# Altium schematic sheet SCH_06_Analog_Mux.SchDoc
size A4; SheetNumber: 11; SheetTotal: 14; SPICEModelCacheGMSWIORD: <root> / <DocumentId>GMSWIORD</DocumentId> / <CacheFrame Number="0"> / <Model Name="0603_885012206095_100nf" Kind="CKT"> / <Text>******* / .subckt 0603_885012206095_100nF 1 2 / Rser 1 3 0.0157659152881 / Lser 2 4 3.10171966E-10 / C1 3 4 0.0000001 / Rpar 3 4 5000000000 / .ends 0603_885012206095_100nF</Text> / </Model> / </CacheFrame> / </root>
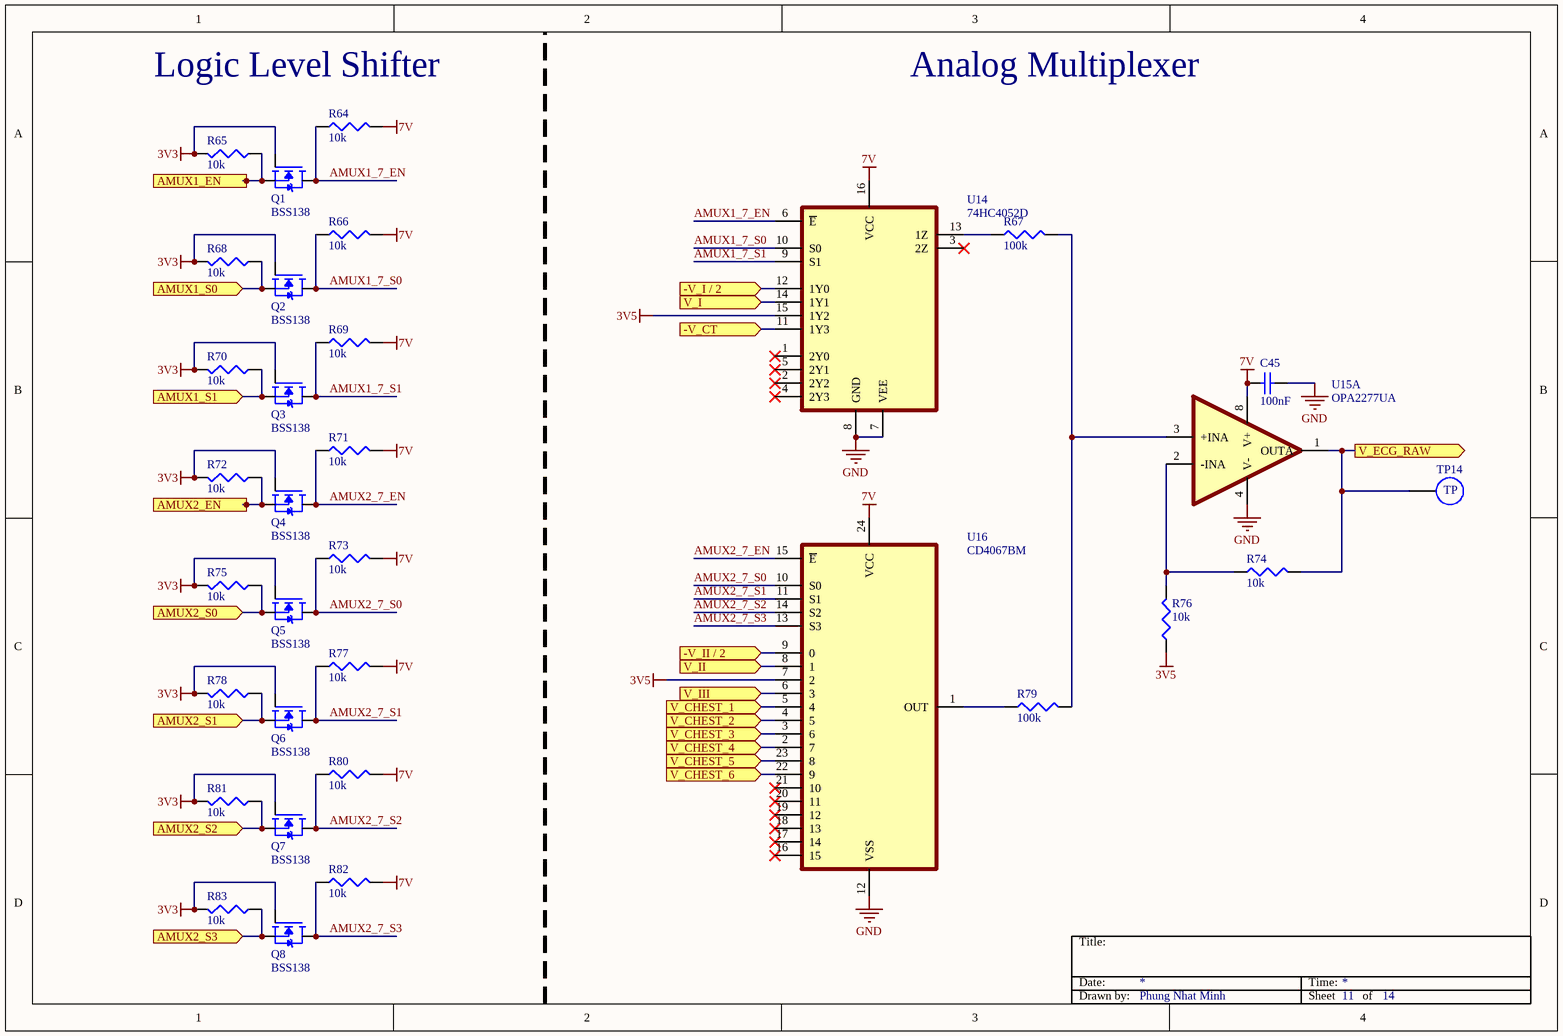
[diagram p0: SCH_06_Analog_Mux.SchDoc]

## Parts
C45  100nF  [WCAP-CSGP_0603_L1.6W0.8H0.8_Reflow]
Q1  BSS138  [SOT95P240X111-3N]
Q2  BSS138  [SOT95P240X111-3N]
Q3  BSS138  [SOT95P240X111-3N]
Q4  BSS138  [SOT95P240X111-3N]
Q5  BSS138  [SOT95P240X111-3N]
Q6  BSS138  [SOT95P240X111-3N]
Q7  BSS138  [SOT95P240X111-3N]
Q8  BSS138  [SOT95P240X111-3N]
R64  10k  [WRIS-PSMB_0603_L1.6W0.8H0.35]
R65  10k  [WRIS-PSMB_0603_L1.6W0.8H0.35]
R66  10k  [WRIS-PSMB_0603_L1.6W0.8H0.35]
R67  100k  [WRIS-PSMB_0603_L1.6W0.8H0.35]
R68  10k  [WRIS-PSMB_0603_L1.6W0.8H0.35]
R69  10k  [WRIS-PSMB_0603_L1.6W0.8H0.35]
R70  10k  [WRIS-PSMB_0603_L1.6W0.8H0.35]
R71  10k  [WRIS-PSMB_0603_L1.6W0.8H0.35]
R72  10k  [WRIS-PSMB_0603_L1.6W0.8H0.35]
R73  10k  [WRIS-PSMB_0603_L1.6W0.8H0.35]
R74  10k  [WRIS-PSMB_0603_L1.6W0.8H0.35]
R75  10k  [WRIS-PSMB_0603_L1.6W0.8H0.35]
R76  10k  [WRIS-PSMB_0603_L1.6W0.8H0.35]
R77  10k  [WRIS-PSMB_0603_L1.6W0.8H0.35]
R78  10k  [WRIS-PSMB_0603_L1.6W0.8H0.35]
R79  100k  [WRIS-PSMB_0603_L1.6W0.8H0.35]
R80  10k  [WRIS-PSMB_0603_L1.6W0.8H0.35]
R81  10k  [WRIS-PSMB_0603_L1.6W0.8H0.35]
R82  10k  [WRIS-PSMB_0603_L1.6W0.8H0.35]
R83  10k  [WRIS-PSMB_0603_L1.6W0.8H0.35]
TP14  Pad_Test_Point  [Pad_Test_Point]  (value not drawn)
U14  74HC4052D  [SOIC127P600X175-16N]
U15  OPA2277UA  [SOIC127P599X175-8N]  (part A of 2)
U16  CD4067BM  [SOIC127P1030X265-24N]

## Ports
-V_CT (in, see Schematic_Top[2B], SCH_05_WCT_RLD[4B]), -V_I / 2 (in, see Schematic_Top[2B], SCH_03_Instrumentation_Amplifier[2B]), -V_II / 2 (in, see Schematic_Top[2B], SCH_03_Instrumentation_Amplifier[4B]), AMUX1_EN (in, see Schematic_Top[3B], SCH_09_InOut_Terminal[2B]), AMUX1_S0 (in, see Schematic_Top[3B], SCH_09_InOut_Terminal[2B]), AMUX1_S1 (in, see Schematic_Top[3B], SCH_09_InOut_Terminal[2B]), AMUX2_EN (in, see Schematic_Top[3B], SCH_09_InOut_Terminal[3B]), AMUX2_S0 (in, see Schematic_Top[3B], SCH_09_InOut_Terminal[3B]), AMUX2_S1 (in, see Schematic_Top[3B], SCH_09_InOut_Terminal[3B]), AMUX2_S2 (in, see Schematic_Top[3B], SCH_09_InOut_Terminal[3B]), AMUX2_S3 (in, see Schematic_Top[3C], SCH_09_InOut_Terminal[3B]), V_CHEST_1 (in, see Schematic_Top[2C], SCH_04_Chest_Lead_Amplifier[2B]), V_CHEST_2 (in, see Schematic_Top[2C], SCH_04_Chest_Lead_Amplifier[4B]), V_CHEST_3 (in, see Schematic_Top[2C], SCH_04_Chest_Lead_Amplifier[2C]), V_CHEST_4 (in, see Schematic_Top[2C], SCH_04_Chest_Lead_Amplifier[4C]), V_CHEST_5 (in, see Schematic_Top[2C], SCH_04_Chest_Lead_Amplifier[2D]), V_CHEST_6 (in, see Schematic_Top[2C], SCH_04_Chest_Lead_Amplifier[4D]), V_ECG_RAW (out, see Schematic_Top[3A], SCH_07_Filter[1B]), V_I (in, see Schematic_Top[2A], SCH_03_Instrumentation_Amplifier[4C]), V_II (in, see Schematic_Top[2B], SCH_03_Instrumentation_Amplifier[4D]), V_III (in, see Schematic_Top[2B], SCH_03_Instrumentation_Amplifier[2C])

## Nets
3V3: Q1.1(G) Q2.1(G) Q3.1(G) Q4.1(G) Q5.1(G) Q6.1(G) Q7.1(G) Q8.1(G) R65.2 R68.2 R70.2 R72.2 R75.2 R78.2 R81.2 R83.2
3V5: R76.1 U14.15(1Y2) U16.7(2)
7V: C45.2 R64.2 R66.2 R69.2 R71.2 R73.2 R77.2 R80.2 R82.2 U14.16(VCC) U15.8(V+) U16.24(VCC)
GND: C45.1 U14.7(VEE) U14.8(GND) U15.4(V-) U16.12(VSS)
-V_CT: U14.11(1Y3) ; port -V_CT
-V_I / 2: U14.12(1Y0) ; port -V_I / 2
-V_II / 2: U16.9(0) ; port -V_II / 2
AMUX1_7_EN: Q1.3(D) R64.1 U14.6(~{E})
AMUX1_7_S0: Q2.3(D) R66.1 U14.10(S0)
AMUX1_7_S1: Q3.3(D) R69.1 U14.9(S1)
AMUX1_EN: Q1.2(S) R65.1 ; port AMUX1_EN
AMUX1_S0: Q2.2(S) R68.1 ; port AMUX1_S0
AMUX1_S1: Q3.2(S) R70.1 ; port AMUX1_S1
AMUX2_7_EN: Q4.3(D) R71.1 U16.15(~{E})
AMUX2_7_S0: Q5.3(D) R73.1 U16.10(S0)
AMUX2_7_S1: Q6.3(D) R77.1 U16.11(S1)
AMUX2_7_S2: Q7.3(D) R80.1 U16.14(S2)
AMUX2_7_S3: Q8.3(D) R82.1 U16.13(S3)
AMUX2_EN: Q4.2(S) R72.1 ; port AMUX2_EN
AMUX2_S0: Q5.2(S) R75.1 ; port AMUX2_S0
AMUX2_S1: Q6.2(S) R78.1 ; port AMUX2_S1
AMUX2_S2: Q7.2(S) R81.1 ; port AMUX2_S2
AMUX2_S3: Q8.2(S) R83.1 ; port AMUX2_S3
V_CHEST_1: U16.5(4) ; port V_CHEST_1
V_CHEST_2: U16.4(5) ; port V_CHEST_2
V_CHEST_3: U16.3(6) ; port V_CHEST_3
V_CHEST_4: U16.2(7) ; port V_CHEST_4
V_CHEST_5: U16.23(8) ; port V_CHEST_5
V_CHEST_6: U16.22(9) ; port V_CHEST_6
V_ECG_RAW: R74.2 TP14.1 U15.1(OUTA) ; port V_ECG_RAW
V_I: U14.14(1Y1) ; port V_I
V_II: U16.8(1) ; port V_II
V_III: U16.6(3) ; port V_III
NetR67_1: R67.1 U14.13(1Z)
NetR67_2: R67.2 R79.2 U15.3(+INA)
NetR74_1: R74.1 R76.2 U15.2(-INA)
NetR79_1: R79.1 U16.1(OUT)

Not connected (* = marked no-connect by the designer): U14 1(2Y0)* 2(2Y2)* 3(2Z)* 4(2Y3)* 5(2Y1)*; U16 16(15)* 17(14)* 18(13)* 19(12)* 20(11)* 21(10)*

## Notes on the sheet
- (near R64) Logic Level Shifter
- Analog Multiplexer
- Title:
- Date:
- Time:
- Drawn by:
- Phung Nhat Minh
- Sheet
- of
- (in symbol Pad_Test_Point) TP

## Library data of the parts
C45 = 885012206095: WCAP-CSGP Multilayer Ceramic Chip Capacitor, General Purpose, size 0603, X7R, 100nF, 50VDC; Manufacturer: Wurth Elektronik; Case/Size Code: 0603; Capacitance Tolerance: +/-10%; Dissipation Factor: 3%; Insulation Resistance: 5GOhm; Rated Voltage (DC): 50V; Technical Reference: X7R0603104K050DFCT10000; Manufacturer Part Number: 885012206095; Category: Multilayer Ceramic Chip Capacitors; Match Code: WCAP-CSGP; ComponentLink1Description: Website Link; ComponentLink1URL: https://www.we-online.com/redexpert/article/885012206095?ad; ComponentLink2Description: Datasheet Link; ComponentLink2URL: https://www.we-online.com/redexpert/spec/885012206095?ad; Mount: Surface Mount; Operating Temperature Max: 125°C; Operating Temperature Min: -55°C; Packaging: Tape and Reel; Length: 1.6mm; Width: 0.8mm; Height: 0.8mm; Capacitance: 100nF; Ceramic Type: X7R
Q1-Q8 = BSS138: N-Channel 50V 220mA (Ta) 360mW (Ta) Surface Mount SOT-23-3; MF: ON Semiconductor; MP: BSS138; Price: None; SnapEDA_Link: https://www.snapeda.com/parts/BSS138/ON%20Semiconductor/view-part/4794929/?ref=snap; Availability: Good; Purchase-URL: https://pricing.snapeda.com/search/part/BSS138/?ref=eda; Value: *; Check_prices: https://www.snapeda.com/parts/BSS138/ON%20Semiconductor/view-part/4794929/?ref=eda; Package: SOT-23 ON Semiconductor
R64-R83 = 580060716001: WRIS-PSMB Metal Plate Resistor, SMT, size 0603, 0.33W, 5mΩ, +/-1%; Manufacturer: Wurth Elektronik; Case/Size Code: 0603; Rated Current: 8.12A; Technical Reference: MB0603R005F103KAATP0000; Temperature Coefficient of Resistance: +/-100ppm/°C; Manufacturer Part Number: 580060716001; Category: Metal Plate Resistors; Match Code: WRIS-PSMB; ComponentLink1Description: Website Link; ComponentLink1URL: https://www.we-online.com/redexpert/article/580060716001?ad; ComponentLink2Description: Datasheet Link; ComponentLink2URL: https://www.we-online.com/redexpert/spec/580060716001?ad; Mount: Surface Mount; Operating Temperature Max: 155°C; Operating Temperature Min: -55°C; Packaging: Tape and Reel; Length: 1.6mm; Width: 0.8mm; Height: 0.35mm; Rated Power: 0.33W; Resistance: 5mΩ; Resistance Tolerance: +/-1%
U14 = 74HC4052D: 2 Circuit IC Switch 4:1 150Ohm 16-SO; MP: 74HC4052D,653; MF: Nexperia USA; SnapEDA_Link: https://www.snapeda.com/parts/74HC4052D,653/Nexperia/view-part/32196/?ref=snap; Purchase-URL: https://pricing.snapeda.com/search/part/74HC4052D,653/?ref=eda; Availability: Good; Value: *; Price: None; Package: SO16-16 Nexperia USA Inc.; Check_prices: https://www.snapeda.com/parts/74HC4052D,653/Nexperia/view-part/32196/?ref=eda
U15 = OPA2277UA: MP: OPA2227UA; Package: None; Price: None; Value: *; Availability: Unavailable